# EAGLE schematic proto (EAGLE 9.6.2)
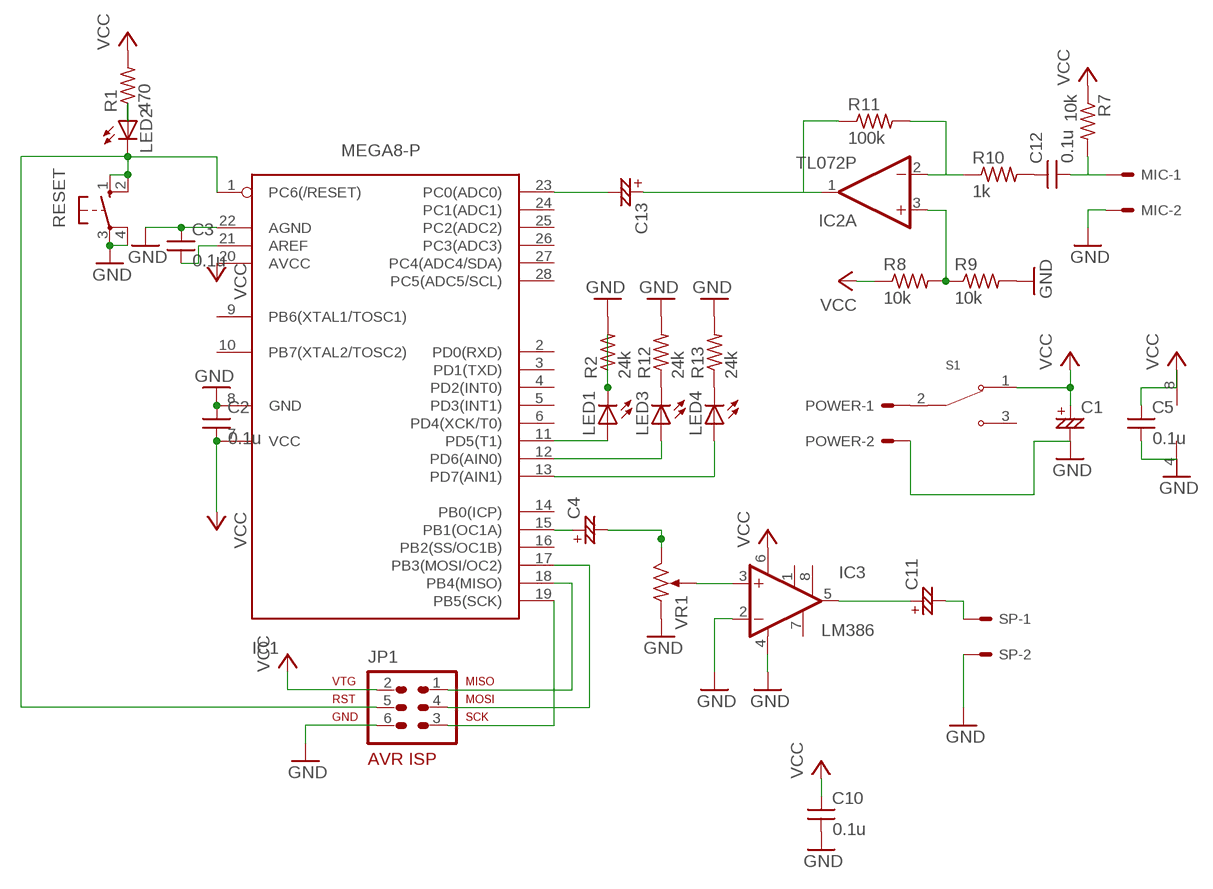
[diagram p0: schematic, sheet 1]

## Parts
C1  E-CAPACITOR-2  [E3,5-8]
C2  0.1u  C-CAPACITOR-2  [C5B3]
C3  0.1u  C-CAPACITOR-2  [C5B3]
C4  E-CAPACITOR-2  [E3,5-8]
C5  0.1u  C-CAPACITOR-2  [C5B3]
C10  0.1u  C-CAPACITOR-2  [C5B3]
C11  E-CAPACITOR-2  [E3,5-8]
C12  0.1u  C-CAPACITOR-2  [C5B3]
C13  E-CAPACITOR-2  [E3,5-8]
IC1  MEGA8-P  [DIL28-3]
IC2  TL072P  [DIL08]
IC3  LM386  [DIL08]
JP1  AVR-ISP-6  [AVR-ISP-6]
LED1  LED3MM  [LED3MM]
LED2  LED3MM  [LED3MM]
LED3  LED3MM  [LED3MM]
LED4  LED3MM  [LED3MM]
MIC  S2P-S  [2P-S]
POWER  S2P-S  [2P-S]
R1  470  RESISTOR-3V  [0207/3V]
R2  24k  RESISTOR-3V  [0207/3V]
R7  10k  RESISTOR-3V  [0207/3V]
R8  10k  RESISTOR-3V  [0207/3V]
R9  10k  RESISTOR-3V  [0207/3V]
R10  1k  RESISTOR-3V  [0207/3V]
R11  100k  RESISTOR-3V  [0207/3V]
R12  24k  RESISTOR-3V  [0207/3V]
R13  24k  RESISTOR-3V  [0207/3V]
RESET  10-XX  [B3F-10XX]
S1  MS12ANW03  [SW_MS12ANW03]
SP  S2P-S  [2P-S]
VR1  V-RESISTOR  [B25X]

## Nets
GND: C1.2 C2.1 C3.1 C5.2 C10.2 IC1.8(GND) IC1.22(AGND) IC3.2(-IN) IC3.4(V-) JP1.6 MIC.2 POWER.2 R2.2 R9.2 R12.2 R13.2 RESET.3(P) RESET.4(P1) SP.2 VR1.2
N$2: POWER.1 S1.2
N$3: C3.2 IC1.21(AREF)
N$4: LED1.K(C) R2.1
N$5: C4.1 IC1.15(PB1(OC1A))
N$6: C13.2 IC1.23(PC0(ADC0))
N$7: C4.2 VR1.1
N$8: IC1.11(PD5(T1)) LED1.A
N$9: IC1.19(PB5(SCK)) JP1.3
N$10: IC1.18(PB4(MISO)) JP1.1
N$11: IC1.17(PB3(MOSI/OC2)) JP1.4
N$12: IC3.3(+IN) VR1.3
N$13: C11.1 IC3.5(OUT)
N$14: C11.2 SP.1
N$15: LED4.K(C) R13.1
N$17: LED2.A R1.1
N$18: C12.2 MIC.1 R7.2
N$19: IC2.3(A:+IN) R8.2 R9.1
N$20: IC2.2(A:-IN) R10.1 R11.2
N$21: C12.1 R10.2
N$22: C13.1 IC2.1(A:OUT) R11.1
N$23: IC1.12(PD6(AIN0)) LED3.A
N$24: LED3.K(C) R12.1
N$25: IC1.13(PD7(AIN1)) LED4.A
N$26: JP1.5
N$29: IC1.1(PC6(/RESET)) LED2.K(C) RESET.1(S) RESET.2(S1)
VCC: C1.1 C2.2 C5.1 C10.1 IC1.7(VCC) IC1.20(AVCC) IC2.8(P:V+) IC3.6(V+) JP1.2 R1.2 R7.1 R8.1 S1.1
Unconnected: IC1.2(PD0(RXD)) IC1.3(PD1(TXD)) IC1.4(PD2(INT0)) IC1.5(PD3(INT1)) IC1.6(PD4(XCK/T0)) IC1.9(PB6(XTAL1/TOSC1)) IC1.10(PB7(XTAL2/TOSC2)) IC1.14(PB0(ICP)) IC1.16(PB2(SS/OC1B)) IC1.24(PC1(ADC1)) IC1.25(PC2(ADC2)) IC1.26(PC3(ADC3)) IC1.27(PC4(ADC4/SDA)) IC1.28(PC5(ADC5/SCL)) IC2.5(B:+IN) IC2.6(B:-IN) IC2.7(B:OUT) IC3.1(GAIN1) IC3.7(GND) IC3.8(GAIN2) S1.3

## Power pins joined to a net without a drawn wire
V-: IC2.4(P:V-)

## Library data of the parts
C1 C4 C11 C13 = 1-cr:E-CAPACITOR: ELECTROLYTIC CAPACITOR
C2 C3 C5 C10 C12 = 1-cr:C-CAPACITOR: CERAMICS CAPACITOR
IC1 = atmel:MEGA8-P: MICROCONTROLLER 8 Kbytes FLASH 1 kbytes SRAM 512 bytes EEPROM USART 4-channel 10 bit ADC 2-channel 8 bit ADC
IC2 = 1-LINEAR:TL072: OP AMP
IC3 = 1-LINEAR:LM386
JP1 = atmel:AVR-ISP-6: AVR ISP-6 Serial Programming Header
LED1-LED4 = led:LED: LED OSRAM: - CHIPLED LG R971, LG N971, LY N971, LG Q971, LY Q971, LO R971, LY R971 LH N974, LH R974 LS Q976, LO Q976, LY Q976 LO Q996 - Hyper CHIPLED LW Q18S LB Q993, LB Q99A, LB R99A - SideLED LS A670, LO A670, LY A670, LG A670, LP A670 LB A673, LV A673, LT A673, LW A673 LH A674 LY A675 LS A676, LA A676, LO A676, LY A676, LW A676 LS A679, LY A679, LG A679 - Hyper Micro SIDELED® LS Y876, LA Y876, LO Y876, LY Y876 LT Y87S - SmartLED LW L88C, LW L88S LB L89C, LB L89S, LG L890 LS L89K, LO L89K, LY L89K LS L896, LA L896, LO L896, LY L896 - TOPLED LS T670, LO T670, LY T670, LG T670, LP T670 LSG T670, LSP T670, LSY T670, LOP T670, LYG T670 LG T671, LOG T671, LSG T671 LB T673, LV T673, LT T673, LW T673 LH T674 LS T676, LA T676, LO T676, LY T676, LB T676, LH T676, LSB T676, LW T676 LB T67C, LV T67C, LT T67C, LS T67K, LO T67K, LY T67K, LW E67C LS E67B, LA E67B, LO E67B, LY E67B, LB E67C, LV E67C, LT E67C LW T67C LS T679, LY T679, LG T679 LS T770, LO T770, LY T770, LG T770, LP T770 LB T773, LV T773, LT T773, LW T773 LH T774 LS E675, LA E675, LY E675, LS T675 LS T776, LA T776, LO T776, LY T776, LB T776 LHGB T686 LT T68C, LB T68C - Hyper Mini TOPLED® LB M676 - Mini TOPLED Santana® LG M470 LS M47K, LO M47K, LY M47K Source: http://www.osram.convergy.de/
MIC POWER SP = 1-conn-jst:S2P
R1 R2 R7-R13 = 1-cr:RESISTOR: RESISTOR 1/4W
RESET = switch-omron:10-XX: OMRON SWITCH
S1 = MS12ANW03:MS12ANW03: Slide Switch SPDT Through Hole Check prices <https://pricing.snapeda.com/parts/MS12ANW03/NKK%20Switches/view-part?ref=eda>; AVAILABILITY: Good; DESCRIPTION: SPDT ON-ON .15 WIDE ACTUATOR PC; MF: NKK Switches; MP: MS12ANW03; PACKAGE: None; PRICE: None; PURCHASE-URL: https://pricing.snapeda.com/search/part/MS12ANW03/?ref=eda
VR1 = 1-cr:V-RESISTOR: VARIABLE RESISTOR